# EAGLE design TeensyLED 15041702 (EAGLE 7.2.0)
DESCRIPTION: SaikoLED TeensyLED Breakout Board; DOCUMENT_NUMBER: 15041400; DRAWING_TITLE: TeensyLED; INFO: Brian Neltner, SaikoLED LLC, neltnerb@saikoled.com; REV: 15041702; VER: X1
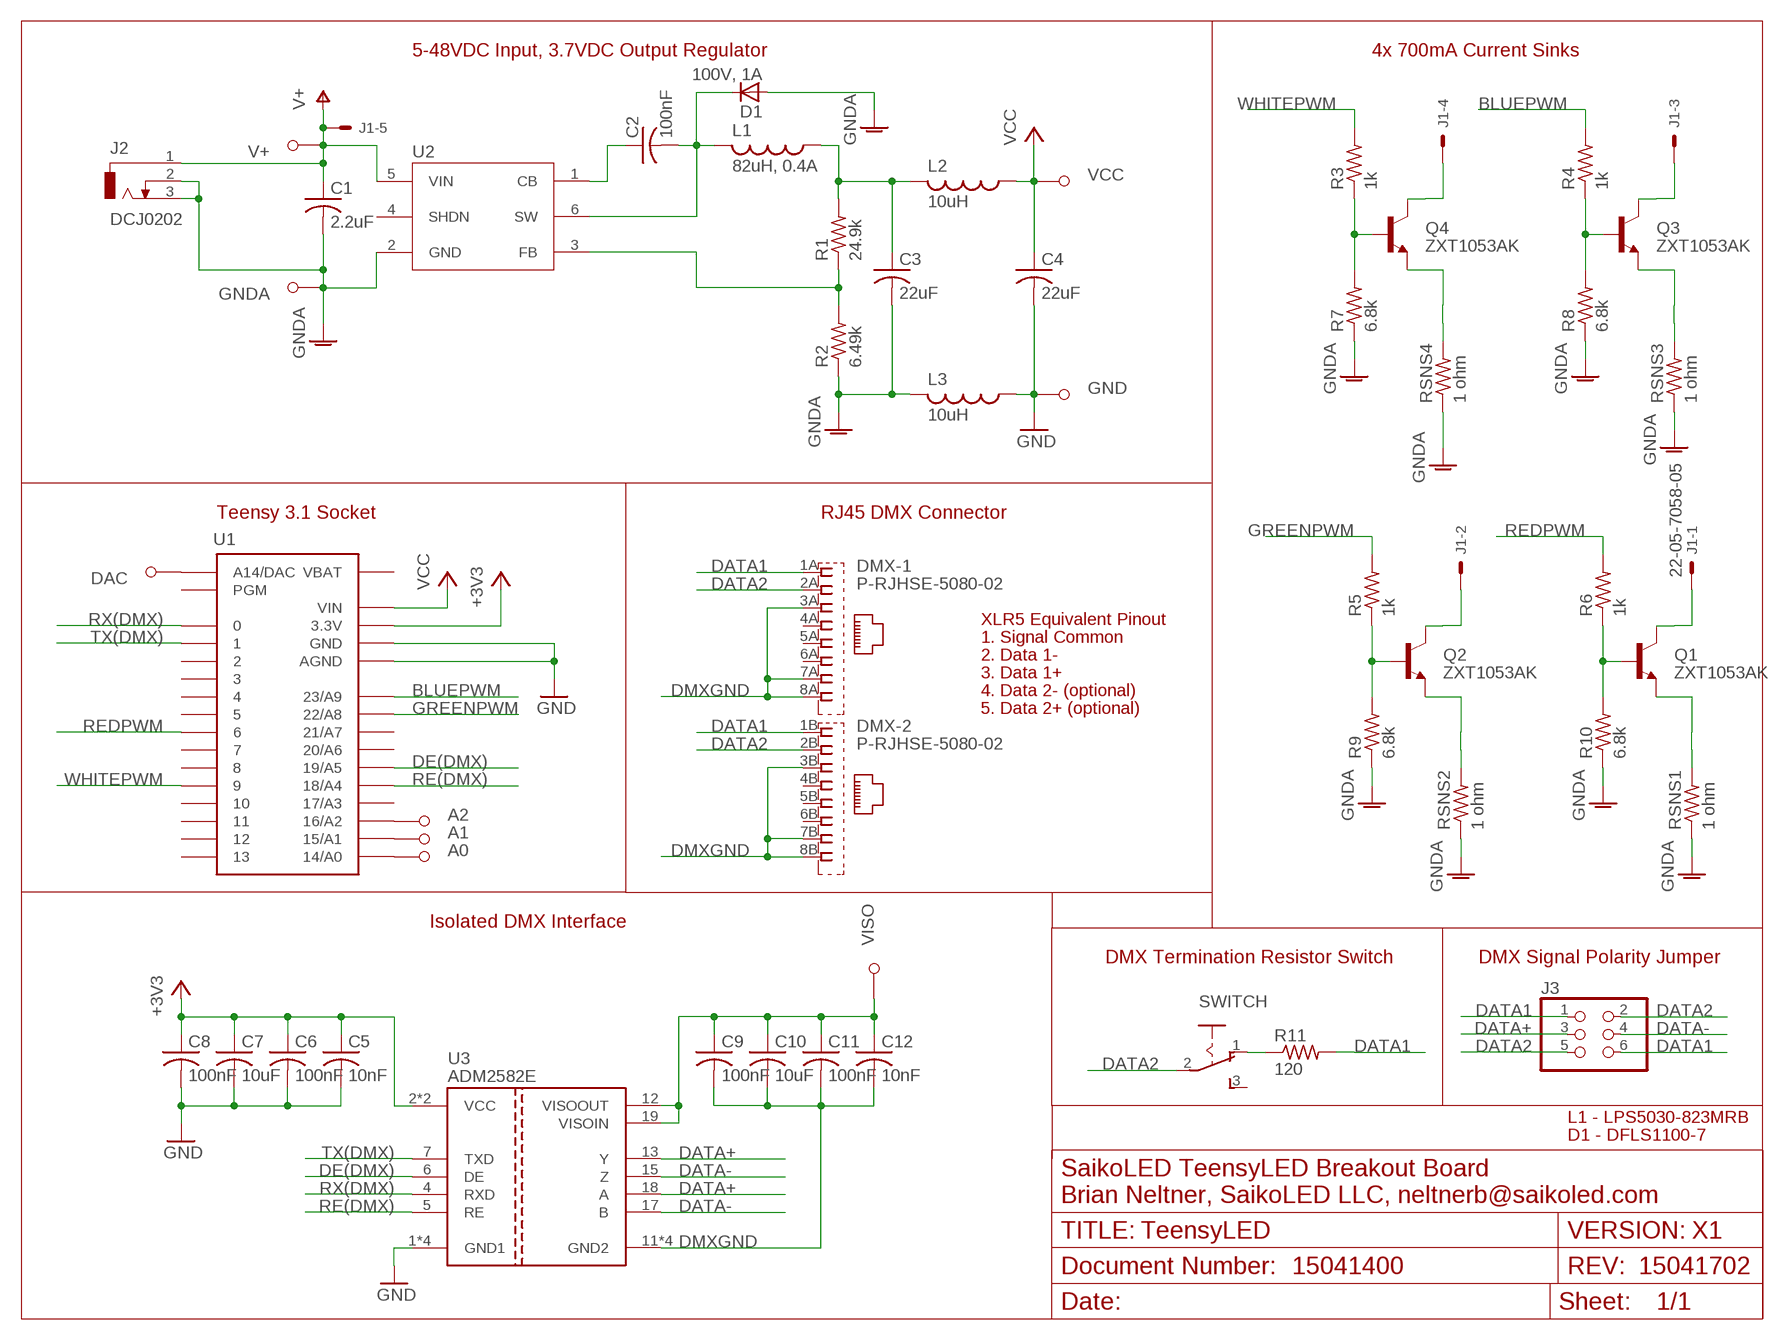
[diagram p0: schematic, sheet 1]

## Parts
A0  5016  [5016]
A1  5016  [5016]
A2  5016  [5016]
C1  2.2uF  C-USC1210K  [C1210K]
C2  100nF  C-USC0805K  [C0805K]
C3  22uF  C-USC0805K  [C0805K]
C4  22uF  C-USC0805K  [C0805K]
C5  10nF  C-USC0402PRO  [C0402PRO]
C6  100nF  C-USC0402PRO  [C0402PRO]
C7  10uF  C-USC0402PRO  [C0402PRO]
C8  100nF  C-USC0402PRO  [C0402PRO]
C9  100nF  C-USC0402PRO  [C0402PRO]
C10  10uF  C-USC0402PRO  [C0402PRO]
C11  100nF  C-USC0402PRO  [C0402PRO]
C12  10nF  C-USC0402PRO  [C0402PRO]
D1  100V, 1A  DFLS1100  [DFLS1100]
DAC  5016  [5016]
DMX  P-RJHSE-5080-02  [P-RJHSE-5080-02]
FRAME1  LETTER_L  [PCBINFO]
GND  5016  [5016]
GNDA  5016  [5016]
J1  22-05-7058-05  [7395-05]
J2  DCJ0202  [DCJ0202]
J3  PINHD-2X3  [2X03]
L1  82uH, 0.4A  L-US  [LPS5030]
L2  10uH  L-USL2012C  [L2012C]
L3  10uH  L-USL2012C  [L2012C]
Q1  ZXT1053AK  [TO252]
Q2  ZXT1053AK  [TO252]
Q3  ZXT1053AK  [TO252]
Q4  ZXT1053AK  [TO252]
R1  24.9k  R-US_R0402PRO  [R0402PRO]
R2  6.49k  R-US_R0402PRO  [R0402PRO]
R3  1k  R-US_R0402PRO  [R0402PRO]
R4  1k  R-US_R0402PRO  [R0402PRO]
R5  1k  R-US_R0402PRO  [R0402PRO]
R6  1k  R-US_R0402PRO  [R0402PRO]
R7  6.8k  R-US_R0402PRO  [R0402PRO]
R8  6.8k  R-US_R0402PRO  [R0402PRO]
R9  6.8k  R-US_R0402PRO  [R0402PRO]
R10  6.8k  R-US_R0402PRO  [R0402PRO]
R11  120  R-US_R0402PRO  [R0402PRO]
RSNS1  1 ohm  R-US_R1206  [R1206]
RSNS2  1 ohm  R-US_R1206  [R1206]
RSNS3  1 ohm  R-US_R1206  [R1206]
RSNS4  1 ohm  R-US_R1206  [R1206]
SWITCH  M251  [SK-12F17-G]
U1  TEENSY_3.0_BASIC  [TEENSY_3.0_BASIC]
U2  LMR16006YDDCT  [DDC0006A]
U3  ADM2582E  [SO-20DW]
V+  5016  [5016]
VCC  5016  [5016]
VISO  5016  [5016]

## Nets
+3V3: C5.1 C6.1 C7.1 C8.1 U1.3.3V U1.3.3V1(3.3V) U3.2(VCC) U3.8(VCC)
BLUEPWM: R4.2 U1.23/A9
DATA1: DMX.1A DMX.1B J3.1 J3.6 R11.2
DATA2: DMX.2A DMX.2B J3.2 J3.5 SWITCH.2(P)
DATA+: J3.3 U3.13(Y) U3.18(A)
DATA-: J3.4 U3.15(Z) U3.17(B)
DE(DMX): U1.19/A5 U3.6(DE)
DMXGND: C9.2 C10.2 C11.2 C12.2 DMX.3A DMX.3B DMX.7A DMX.7B DMX.8A DMX.8B U3.11(GND2) U3.14(GND2) U3.16(GND2) U3.20(GND2)
GND: C4.2 C5.2 C6.2 C7.2 C8.2 GND.P$1 L3.1 U1.AGND U1.GND U1.GND1(GND) U3.1(GND1) U3.3(GND1) U3.9(GND1) U3.10(GND1)
GNDA: C1.2 C3.2 D1.A GNDA.P$1 J2.2 J2.3 L3.2 R2.1 R7.1 R8.1 R9.1 R10.1 RSNS1.1 RSNS2.1 RSNS3.1 RSNS4.1 U2.2(GND)
GREENPWM: R5.2 U1.22/A8
N$1: C2.2 D1.C L1.P$2 U2.6(SW)
N$2: C2.1 U2.1(CB)
N$3: J1.3 Q3.C
N$5: R1.1 R2.2 U2.3(FB)
N$6: J1.1 Q1.C
N$7: J1.2 Q2.C
N$8: Q2.E RSNS2.2
N$9: C3.1 L1.P$1 L2.2 R1.2
N$10: C9.1 C10.1 C11.1 C12.1 U3.12(VISOOUT) U3.19(VISOIN) VISO.P$1
N$11: Q4.E RSNS4.2
N$12: Q3.E RSNS3.2
N$13: DAC.P$1 U1.RESET(A14/DAC)
N$14: R11.1 SWITCH.1(O)
N$15: Q1.E RSNS1.2
N$16: Q2.B R5.1 R9.2
N$17: A0.P$1 U1.14/A0
N$18: A1.P$1 U1.15/A1
N$19: A2.P$1 U1.16/A2
N$20: Q4.B R3.1 R7.2
N$22: Q1.B R6.1 R10.2
Q4: J1.4 Q4.C
R23: Q3.B R4.1 R8.2
RE(DMX): U1.18/A4 U3.5(RE)
REDPWM: R6.2 U1.6
RX(DMX): U1.0 U3.4(RXD)
TX(DMX): U1.1 U3.7(TXD)
V+: C1.1 J1.5 J2.1 U2.5(VIN) V+.P$1
VCC: C4.1 L2.1 U1.VIN VCC.P$1
WHITEPWM: R3.2 U1.9
Unconnected: DMX.4A DMX.4B DMX.5A DMX.5B DMX.6A DMX.6B SWITCH.3(S) U1.2 U1.3 U1.4 U1.5 U1.7 U1.8 U1.10 U1.11 U1.12 U1.13 U1.17/A3 U1.20/A6 U1.21/A7 U1.PGM U2.4(SHDN)

## Notes on the sheet
- 5-48VDC Input, 3.7VDC Output Regulator | 4x 700mA Current Sinks
- Teensy 3.1 Socket | RJ45 DMX Connector
- XLR5 Equivalent Pinout
- 1. Signal Common
- 2. Data 1-
- 3. Data 1+
- 4. Data 2- (optional)
- 5. Data 2+ (optional)
- Isolated DMX Interface
- DMX Termination Resistor Switch | DMX Signal Polarity Jumper
- L1 - LPS5030-823MRB
- D1 - DFLS1100-7

## Power pins joined to a net without a drawn wire
VBAT: U1.VBAT

## Library data of the parts
A0 A1 A2 DAC GND GNDA V+ VCC VISO = 0_keystone:5016
C1 C2 = rcl:C-US: CAPACITOR, American symbol; OC_NEWARK: unknown
C3 = rcl:C-US: CAPACITOR, American symbol; MF: Multicomp Passives; MPN: MCLV4R7M1HB-0513-RH; OC_NEWARK: 79K3674
C4-C12 = rcl:C-US: CAPACITOR, American symbol
D1 = 0_diodes:DFLS1100: Reference DIODE temperature compensated, 6,2 V
DMX = 0_amphenol:P-RJHSE-5080-02: Mod. Jack, Right Angle, 8 posiotion, 8 contatcs RJ45 Source: GLX-S-88M.pdf
FRAME1 = frames:LETTER_L: FRAME LETTER landscape
J1 = con-molex:22-?-05: CONNECTOR wire to board 2.54 mm (.1 inch) pitch header; OC_FARNELL: unknown; OC_NEWARK: unknown
J2 = con-jack:DCJ0202: DC POWER JACK Source: DCJ0202.pdf; OC_FARNELL: unknown; OC_NEWARK: unknown
J3 = pinhead:PINHD-2X3: PIN HEADER
L1 = 0_coilcraft:L-US: INDUCTOR, American symbol
L2 L3 = rcl:L-US: INDUCTOR, American symbol
Q1-Q4 = 0_diodes:ZXT1053AK: NPN Transistor ZXT1053AK DPAK TRANSISTOR 5A, 75V, hFE=300@1A, 4.4W
R1 = rcl:R-US_: RESISTOR, American symbol; MPN: BLU0402-9762-BT25W; OC_NEWARK: 32Y2244
R2 = rcl:R-US_: RESISTOR, American symbol; MPN: ERJ-3EKF4123V; OC_NEWARK: 53W4620
R3-R11 RSNS1-RSNS4 = rcl:R-US_: RESISTOR, American symbol
SWITCH = 0_comax:M251: SLIDING SWITCH Mors, distributor Buerklin, 11G702
U1 = Teensy3.0:TEENSY_3.0_BASIC: Basic Teensy 3.0 with none of the 'inner' pins enabled. See '+4', 'AllAnalogPins", and 'AllPins' packages for additional pin holes, as needed.
U2 = 0_texas_instruments:LMR16006YDDCT; COMPTYPE: IC; MANUFACTURER: Texas Instruments; MANUFACTURER_NAME: Texas Instruments; MANUFACTURER_PART_NUMBER: LMR16006YDDCT; MF: FARNELL; MOUNTTYPE: SMT; MPN: MCF 0.25W 1K; OC_NEWARK: 38K0327; PACKAGEREFERENCE: DDC0006A; PARTNUMBER: LMR16006YDDC; PIN_COUNT: 6; REFDES: RefDes; ROHS: Y; TYPE: TYPE; VALUE: Value
U3 = 0_analog_devices:ADM2582E

## Board
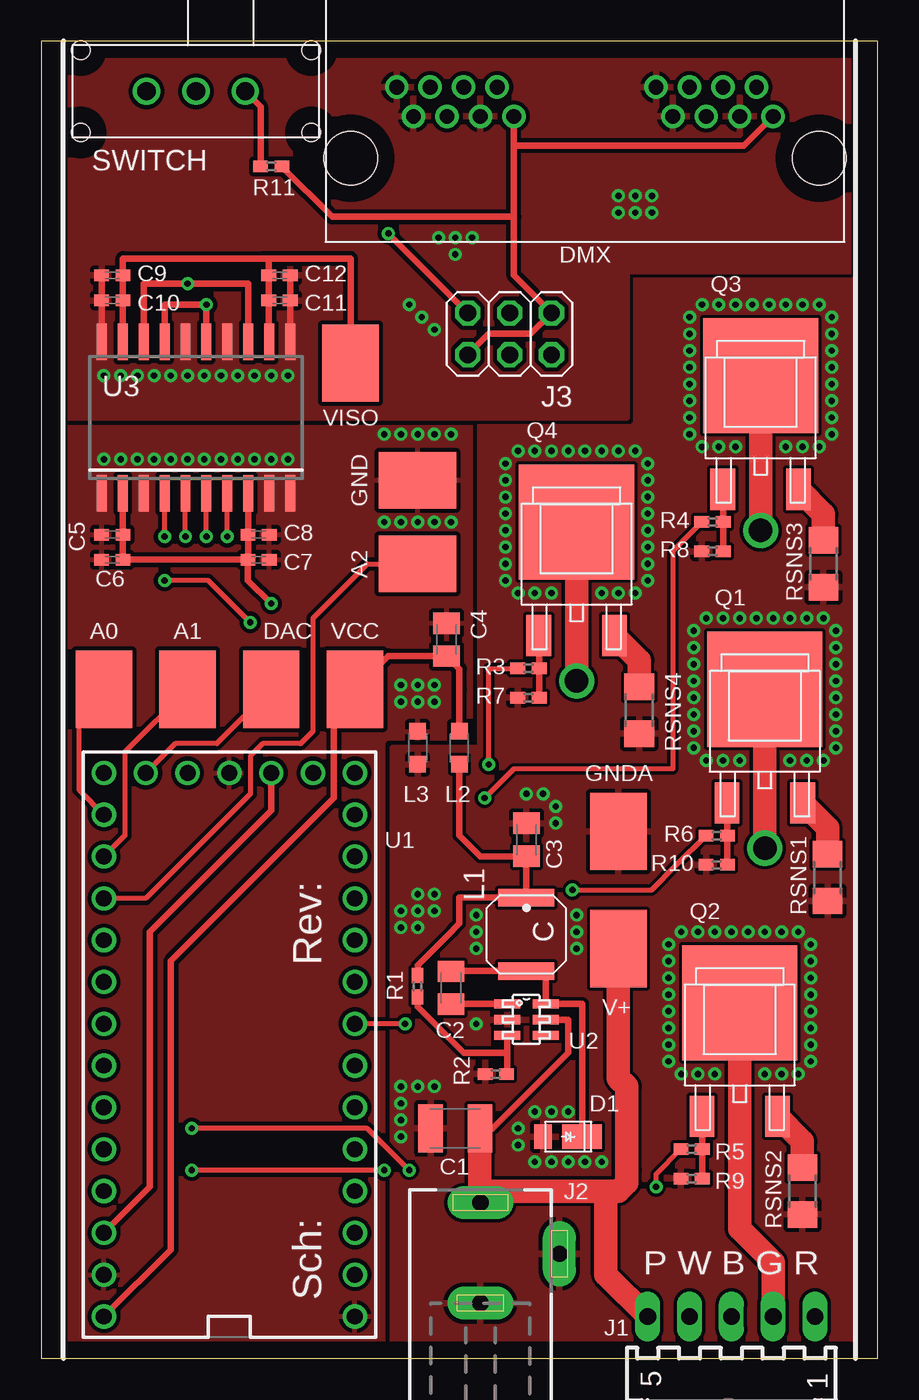
[diagram p1: board, top side]
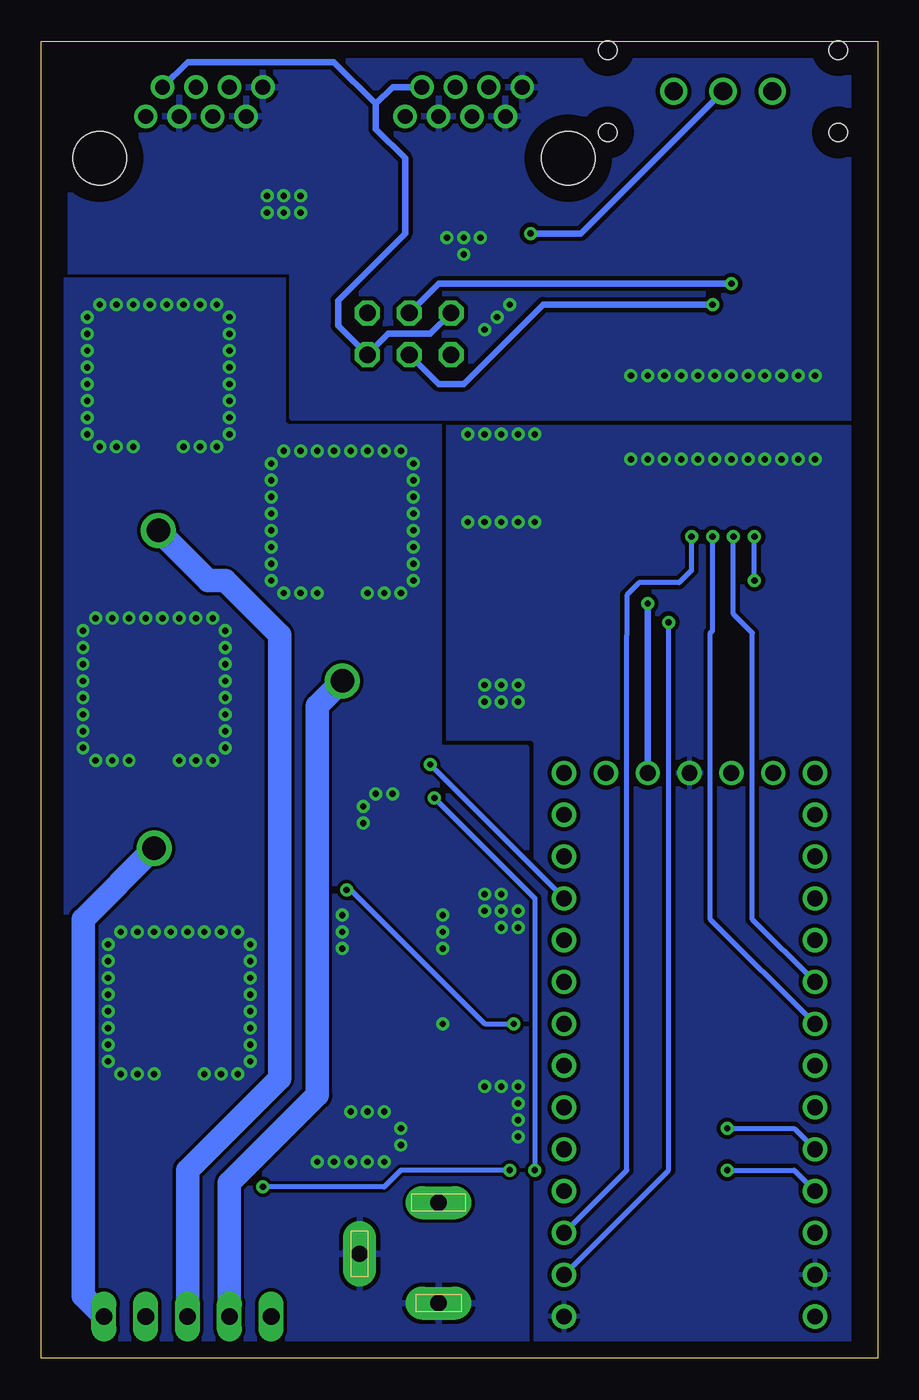
[diagram p2: board, bottom side, seen from below]

Size 50.8 x 80.01 mm. Coordinates in mm from the lower left corner, seen from the top.
Outline: 0,0 50.8,0 50.8,80.01 0,80.01 0,0
Copper layers (1*16): Top 0.035mm / dielectric 1.5mm / Bottom 0.035mm
Design rules "default *": minimum track width 12mil, minimum drill 15mil, track to track 8mil, track to pad 8mil, pad to pad 8mil, via to via 8mil, smd to smd 8mil, copper to edge 40mil, drill to drill 8mil, minimum pad ring 10mil, minimum via ring 8mil, stop-mask expansion 4mil, vias tented up to drill 0mil, thermal gap 10mil
tRestrict: area 0,0 to 1.3,80; area 49.5,0 to 50.8,80
bRestrict: area 0,0 to 1.3,80; area 49.5,0 to 50.8,80

### Footprints (pad centres in the part's own frame; a part is rotated, then mirrored left to right if it is on the bottom)
5016 = smd 4.699 x 3.429: P$1 0,0
C1210K = smd 1.5 x 2.9: 1 -1.5,0; 2 1.5,0
C0805K = smd 1.3 x 1.6: 1 -1,0; 2 1,0
C0402PRO = smd 0.9 x 0.7: 1 -0.65,0; 2 0.65,0
DFLS1100 = smd 1.05 x 1.5: A -1.525,0 | smd 2.4 x 1.5: C 0.85,0
P-RJHSE-5080-02 = drill 0.9 pad 1.422: 1A 11.43,2.54; 1B -4.318,2.54; 2A 10.414,4.318; 2B -5.334,4.318; 3A 9.398,2.54; 3B -6.35,2.54; 4A 8.382,4.318; 4B -7.366,4.318; 5A 7.366,2.54; 5B -8.382,2.54; 6A 6.35,4.318; 6B -9.398,4.318; 7A 5.334,2.54; 7B -10.414,2.54; 8A 4.318,4.318; 8B -11.43,4.318 | hole 3.251: -14.224,0; 14.224,0
7395-05 = drill 1.016 long: 1 5.08,0; 2 2.54,0; 3 0,0; 4 -2.54,0; 5 -5.08,0
DCJ0202 = drill 1 pad 2 long: 1 0,3.1; 2 4.8,0; 3 0,-3
2X03 = drill 1.016 octagon: 1 -2.54,-1.27; 2 -2.54,1.27; 3 0,-1.27; 4 0,1.27; 5 2.54,-1.27; 6 2.54,1.27
LPS5030 = smd 1.067 x 3.404: P$1 -2.235,0; P$2 2.235,0
L2012C = smd 1 x 1: 1 -1,0; 2 1,0
TO252 = smd 1.5 x 2.5: B -2.3,-6.9; E 2.3,-6.9 | smd 7 x 7: C 0,0
R0402PRO = smd 0.9 x 0.7: 1 -0.65,0; 2 0.65,0
R1206 = smd 1.6 x 1.803: 1 -1.422,0; 2 1.422,0
SK-12F17-G = drill 1.1: 1 -3,0; 2 0,0; 3 3,0 | hole 1.1: -7,2.5; -7,-2.5; 7,-2.5; 7,2.5
TEENSY_3.0_BASIC = drill 0.965: 0 -7.62,13.97; 1 -7.62,11.43; 2 -7.62,8.89; 3 -7.62,6.35; 3.3V 7.62,11.43; 3.3V1 -2.54,-16.51; 4 -7.62,3.81; 5 -7.62,1.27; 6 -7.62,-1.27; 7 -7.62,-3.81; 8 -7.62,-6.35; 9 -7.62,-8.89; 10 -7.62,-11.43; 11 -7.62,-13.97; 12 -7.62,-16.51; 13 7.62,-16.51; 14/A0 7.62,-13.97; 15/A1 7.62,-11.43; 16/A2 7.62,-8.89; 17/A3 7.62,-6.35; 18/A4 7.62,-3.81; 19/A5 7.62,-1.27; 20/A6 7.62,1.27; 21/A7 7.62,3.81; 22/A8 7.62,6.35; 23/A9 7.62,8.89; AGND 7.62,13.97; GND -7.62,16.51; GND1 0,-16.51; PGM 2.54,-16.51; RESET 5.08,-16.51; VBAT -5.08,-16.51; VIN 7.62,16.51
DDC0006A = smd 1.575 x 0.559: 1 -1.168,0.95; 2 -1.168,0; 3 -1.168,-0.95; 4 1.168,-0.95; 5 1.168,0; 6 1.168,0.95
SO-20DW = smd 0.6 x 2.2: 1 -5.715,-4.6; 2 -4.445,-4.6; 3 -3.175,-4.6; 4 -1.905,-4.6; 5 -0.635,-4.6; 6 0.635,-4.6; 7 1.905,-4.6; 8 3.175,-4.6; 9 4.445,-4.6; 10 5.715,-4.6; 11 5.715,4.6; 12 4.445,4.6; 13 3.175,4.6; 14 1.905,4.6; 15 0.635,4.6; 16 -0.635,4.6; 17 -1.905,4.6; 18 -3.175,4.6; 19 -4.445,4.6; 20 -5.715,4.6

### Placement (x,y rotation side)
A0  3.81,40.64 270 top
A1  8.89,40.64 270 top
A2  22.86,48.26 0 top
C1  25.15,13.97 180 top
C2  24.89,22.5 90 top
C3  29.46,31.5 90 top
C4  24.61,43.66 90 top
C5  4.32,50.04 180 top
C6  4.32,48.51 180 top
C7  13.21,48.51 0 top
C8  13.21,50.04 0 top
C9  4.32,65.79 180 top
C10  4.32,64.26 180 top
C11  14.48,64.26 0 top
C12  14.48,65.79 0 top
D1  32,13.46 0 top
DAC  13.97,40.64 270 top
DMX  33.02,72.9 0 top
FRAME1  17.02,3.56 90 top
GND  22.86,53.34 0 top
GNDA  35.05,32 270 top
J1  41.91,2.54 0 top
J2  26.67,6.35 0 top
J3  28.45,62.23 180 top
L1  29.46,25.76 270 top
L2  25.4,37.08 270 top
L3  22.86,37.08 270 top
Q1  43.94,40.64 0 top
Q2  42.42,21.59 0 top
Q3  43.69,59.69 0 top
Q4  32.51,50.8 0 top
R1  22.86,22.61 90 top
R2  27.61,17.27 0 top
R3  29.59,41.91 180 top
R4  40.77,50.8 180 top
R5  39.5,12.7 180 top
R6  41.02,31.75 180 top
R7  29.59,40.13 0 top
R8  40.77,49.02 0 top
R9  39.5,10.92 0 top
R10  41.02,29.97 0 top
R11  13.97,72.39 0 top
RSNS1  47.75,29.21 90 top
RSNS2  46.23,10.16 90 top
RSNS3  47.5,48.26 90 top
RSNS4  36.32,39.37 90 top
SWITCH  9.4,76.96 180 top
U1  11.43,19.05 180 top
U2  29.46,20.57 0 top
U3  9.4,57.15 0 top
V+  35.05,24.89 90 top
VCC  19.05,40.64 270 top
VISO  18.8,60.45 270 top

### Tracks (layer width: path | path; a pad name or v marks a point on that pad's centre or on a via)
+3V3  (via drill 0.38)
  Top 0.305: 4.95,48.58 C6.1 | 4.95,49.85 C5.1 4.95,50.16 | 4.95,52.39 U3.2 | 12.57,48.58 C7.1 | 12.57,49.85 C8.1 12.57,50.16 | 12.57,52.39 U3.8
  Top 0.406: 4.95,49.85 4.95,48.58 | 4.95,52.39 4.95,50.16 | 12.57,49.85 12.57,48.58 | 12.57,52.39 12.57,50.16 | C6.1 C7.1 12.56,47.26 v13.97,45.85 | U1.3.3V1 13.97,33.27 6.6,25.91 6.6,10.41 U1.3.3V
  Bottom 0.406: U1.3.3V1 v13.97,45.85
BLUEPWM  (via drill 0.38)
  Top 0.305: R4.2 38.35,49.04 38.35,35.81 28.7,35.81 v26.92,34.04 | v20.83,11.43 v9.14,11.43
  Bottom 0.305: v26.92,34.04 20.83,27.94 v20.83,11.43 | v9.14,11.43 5.08,11.43 U1.23/A9
DATA1
  Top 0.406: J3.6 27.18,62.23 29.72,62.23 J3.1 28.7,65.79 28.7,69.34 | 28.7,69.34 28.7,73.66 | 28.7,73.66 DMX.1B | DMX.1A 42.67,73.66 28.7,73.66 | R11.2 17.67,69.34 28.7,69.34
DATA2  (via drill 0.38)
  Top 0.406: v21.08,68.33 J3.5
  Bottom 0.406: J3.5 27.18,62.23 29.72,62.23 J3.2 32.77,62.74 32.77,64.26 28.7,68.33 28.7,72.9 30.48,74.68 30.48,76.2 | SWITCH.2 18.03,68.33 v21.08,68.33 | DMX.2B 29.46,77.22 30.48,76.2 | 30.48,76.2 33.02,78.74 41.91,78.74 DMX.2A
DATA+  (via drill 0.38)
  Top 0.406: U3.18 6.22,65.28 v8.89,65.28 8.64,65.28 12.57,65.28 U3.13
  Bottom 0.406: v8.89,65.28 26.67,65.28 J3.3
DATA-  (via drill 0.38)
  Top 0.406: U3.17 7.49,64.01 9.91,64.01 v10.03,64.01 U3.15
  Bottom 0.406: J3.4 26.67,59.18 25.4,59.18 25.15,59.18 20.32,64.01 v10.03,64.01
DE(DMX)  (via drill 0.38)
  Top 0.305: v10.03,49.91 U3.6
  Bottom 0.305: U1.19/A5 10.16,26.67 10.16,44.07 10.03,44.2 v10.03,49.91
DMXGND  (via drill 0.38)
  Top 0.305: 11.3,61.91 U3.14
  Top 0.406: U3.11 15.11,64.26 C11.2 C12.2 | C9.2 C10.2 3.68,64.26 U3.20
  other vias: 3.81,59.69 4.83,59.69 5.84,59.69 6.86,59.69 7.87,59.69 8.89,59.69 9.91,59.69 10.92,59.69 11.94,59.69 12.95,59.69 13.97,59.69 14.99,59.69 35.05,70.61 35.05,69.6 36.07,70.61 36.07,69.6 37.08,70.61 37.08,69.6 24.13,68.07 25.15,68.07 26.16,68.07 25.15,67.06 22.35,64.01 23.11,63.25 23.88,62.48
  pour Top (isolate 0.254): 0,57.15 35.56,57.15 35.56,66.04 50.8,66.04 50.8,80.01 0,80.01
  pour Bottom (isolate 0.254): 0,57.15 35.56,57.15 35.56,66.04 50.8,66.04 50.8,80.01 0,80.01
GND  (via drill 0.38)
  other vias: 14.99,54.61 13.97,54.61 12.95,54.61 11.94,54.61 10.92,54.61 9.91,54.61 8.89,54.61 7.87,54.61 6.86,54.61 5.84,54.61 4.83,54.61 3.81,54.61 20.83,56.13 21.84,56.13 22.86,56.13 23.88,56.13 24.89,56.13 20.83,50.8 21.84,50.8 22.86,50.8 23.88,50.8 24.89,50.8 23.88,40.89 23.88,39.88 22.86,39.88 22.86,40.89 21.84,40.89 21.84,39.88
  pour Top (isolate 0.254, rank 3): 0,0 50.8,0 50.8,80.01 0,80.01
  pour Bottom (isolate 0.254, rank 3): 0,0 50.8,0 50.8,80.01 0,80.01
GNDA  (via drill 0.38)
  other vias: 26.42,20.32 22.86,28.19 23.88,28.19 23.88,27.18 22.86,27.18 21.84,27.18 21.84,26.16 22.86,26.16 29.46,34.29 30.48,34.29 31.24,33.53 31.24,32.51 32,14.99 30.99,14.99 29.97,14.99 28.96,13.97 28.96,12.95 28.19,51.31 28.19,50.29 28.19,49.28 28.19,48.26 28.19,47.24 28.96,46.48 29.97,46.48 34.04,55.12 28.19,54.36 28.19,53.34 28.19,52.32 28.96,55.12 29.97,55.12 30.99,55.12 32,55.12 33.02,55.12 36.07,55.12 35.05,55.12 36.83,54.36 36.83,53.34 36.83,52.32 36.83,51.31 36.83,50.29 36.83,49.28 36.83,48.26 36.83,47.24 36.07,46.48 35.05,46.48 30.99,46.48 34.04,46.48 39.37,60.2 39.37,59.18 39.37,58.17 39.37,57.15 39.37,56.13 40.13,55.37 41.15,55.37 45.21,64.01 39.37,63.25 39.37,62.23 39.37,61.21 40.13,64.01 41.15,64.01 42.16,64.01 43.18,64.01 44.2,64.01 47.24,64.01 46.23,64.01 48.01,63.25 48.01,62.23 48.01,61.21 48.01,60.2 48.01,59.18 48.01,58.17 48.01,57.15 48.01,56.13 47.24,55.37 46.23,55.37 42.16,55.37 45.21,55.37 39.62,41.15 39.62,40.13 39.62,39.12 39.62,38.1 39.62,37.08 40.39,36.32 41.4,36.32 45.47,44.96 39.62,44.2 39.62,43.18 39.62,42.16 40.39,44.96 41.4,44.96 42.42,44.96 43.43,44.96 44.45,44.96 47.5,44.96 46.48,44.96 48.26,44.2 48.26,43.18 48.26,42.16 48.26,41.15 48.26,40.13 48.26,39.12 48.26,38.1 48.26,37.08 47.5,36.32 46.48,36.32 42.42,36.32 45.47,36.32 38.1,22.1 38.1,21.08 38.1,20.07 38.1,19.05 38.1,18.03 38.86,17.27 39.88,17.27 43.94,25.91 38.1,25.15 38.1,24.13 38.1,23.11 38.86,25.91 39.88,25.91 40.89,25.91 41.91,25.91 42.93,25.91 45.97,25.91 44.96,25.91 46.74,25.15 46.74,24.13 46.74,23.11 46.74,22.1 46.74,21.08 46.74,20.07 46.74,19.05 46.74,18.03 45.97,17.27 44.96,17.27 40.89,17.27 43.94,17.27 26.42,26.92 26.42,25.91 26.42,24.89 32.51,26.92 32.51,25.91 32.51,24.89 29.97,11.94 30.99,11.94 32,11.94 33.02,11.94 34.04,11.94 23.88,16.51 22.86,16.51 21.84,16.51 21.84,15.49 21.84,14.48 21.84,13.46
  pour Bottom (rank 2): 21.34,0 21.34,37.08 26.67,37.08 26.67,57.15 35.56,57.15 35.56,66.04 50.8,66.04 50.8,0
  pour Top (rank 2): 21.34,0 21.34,37.08 26.67,37.08 26.67,57.15 35.56,57.15 35.56,66.04 50.8,66.04 50.8,0
GREENPWM  (via drill 0.38)
  Top 0.305: v22.35,11.43 19.81,13.97 v9.14,13.97 | v37.34,10.41 37.34,11.19 R5.2
  Bottom 0.305: v22.35,11.43 28.96,11.43 29.97,10.41 v37.34,10.41 | v9.14,13.97 5.08,13.97 U1.22/A8
N$1
  Top 0.406: C2.2 25.65,23.52 L1.P$2 30.63,23.52 U2.6 32.85,21.52 D1.C
N$2
  Top 0.406: U2.1 25.65,21.52 C2.1
N$3  (via drill 1.42)
  Top 1.422: v43.69,50.29 Q3.C
  Bottom 1.422: J1.3 41.91,11.43 36.32,17.02 36.32,43.94 39.62,47.24 40.64,47.24 v43.69,50.29
N$5
  Top 0.305: 28.3,17.27 R2.2
  Top 0.406: 28.3,18.54 U2.3 | R1.1 22.86,21.34 25.65,18.54 28.3,18.54 | 28.3,18.54 28.3,17.27
N$6  (via drill 1.42)
  Top 1.422: v43.94,30.99 Q1.C
  Bottom 1.422: v43.94,30.99 48.26,26.67 48.26,3.81 J1.1
N$7
  Top 1.422: J1.2 44.45,5.84 42.42,7.87 Q2.C
N$8
  Top 1.422: RSNS2.2 46.23,13.18 Q2.E
N$9
  Top 0.406: R1.2 22.86,23.88 24.89,25.91 25.15,26.16 25.4,26.42 25.4,27.18 25.4,27.99 L1.P$1 C3.1 26.65,30.5 25.4,31.75 L2.2
N$10
  Top 0.406: U3.12 13.83,61.75 C11.1 C12.1 13.83,66.8 | U3.19 4.95,64.26 C10.1 C9.1 4.97,66.8 13.46,66.8 13.83,66.8 | VISO.P$1 18.8,66.8 13.83,66.8
N$11
  Top 1.422: RSNS4.2 36.32,42.39 Q4.E
N$12
  Top 1.422: RSNS3.2 47.5,51.28 Q3.E
N$13
  Top 0.305: DAC.P$1 10.67,37.34 8.13,37.34 U1.RESET
N$14
  Top 0.406: SWITCH.1 13.32,76.04 R11.1
N$15
  Top 1.422: RSNS1.2 47.75,32.23 Q1.E
N$16
  Top 0.406: Q2.B 40.15,14.69 R5.1 R9.2
N$17
  Top 0.305: A0.P$1 2.29,39.12 2.29,34.54 U1.14/A0
N$18
  Top 0.305: A1.P$1 5.08,36.83 5.08,31.75 U1.15/A1
N$19
  Top 0.305: U1.16/A2 6.35,27.94 12.7,34.29 12.7,36.58 13.46,37.34 15.75,37.34 16.51,38.1 16.51,44.96 19.81,48.26 A2.P$1
N$20
  Top 0.406: Q4.B 30.24,43.9 R3.1 R7.2
N$22
  Top 0.406: Q1.B 41.67,33.74 R6.1 R10.2
Q4  (via drill 1.42)
  Top 1.422: v32.51,41.15 Q4.C
  Bottom 1.422: J1.4 39.37,10.67 34.04,16 34.04,39.62 v32.51,41.15
R23
  Top 0.406: Q3.B 41.42,52.79 R4.1 R8.2
RE(DMX)  (via drill 0.38)
  Top 0.305: v8.76,49.91 U3.5
  Bottom 0.305: U1.18/A4 7.62,26.67 7.62,44.07 8.76,45.21 v8.76,49.91
REDPWM  (via drill 0.38)
  Top 0.305: v22.1,20.32 U1.6 | R6.2 38.61,29.99 37.07,28.45 v32.26,28.45
  Bottom 0.305: v22.1,20.32 23.88,20.32 32,28.45 v32.26,28.45
RX(DMX)  (via drill 0.38)
  Top 0.305: v7.49,49.91 U3.4 | v12.7,44.7 10.16,47.24 v7.49,47.24
  Bottom 0.305: U1.0 12.7,11.43 v12.7,44.7 | v7.49,47.24 v7.49,49.91
TX(DMX)  (via drill 0.38)
  Top 0.305: v11.3,49.91 U3.7
  Bottom 0.305: U1.1 15.24,11.43 15.24,43.94 15.24,46.35 14.48,47.12 12.06,47.12 11.3,47.88 v11.3,49.91
V+
  Top 0.406: C1.1 27.43,13.97 32,18.54 32,20.57 U2.5
  Top 1.422: J2.1 26.65,9.47 26.65,10.16 | 26.65,10.16 C1.1 | J1.5 34.29,5.08 34.29,10.16 | 34.29,10.16 26.65,10.16 | V+.P$1 35.05,17.02 35.56,16.51 35.56,11.43 35.56,10.67 35.05,10.16 34.29,10.16
VCC
  Top 0.406: U1.VIN 7.87,6.6 7.87,8.64 7.87,24.13 17.78,34.04 17.78,39.37 VCC.P$1 21.07,42.66 C4.1 25.4,41.88 25.4,40.64 L2.1
WHITEPWM  (via drill 0.38)
  Top 0.305: v27.18,36.07 27.18,41.91 R3.2
  Bottom 0.305: U1.9 v27.18,36.07

### Text on the board
tPlace: P W B G R